# EAGLE schematic sensortester (EAGLE 7.6.0)
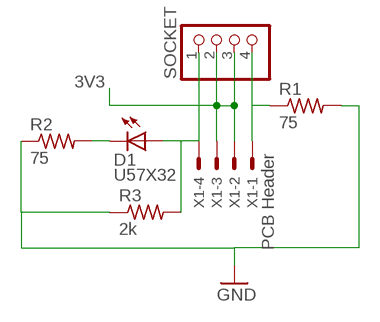
[diagram p0: schematic, sheet 1]

## Parts
D1  U57X32  [U57X32]
R1  75  R-US_0204/5  [0204/5]
R2  75  R-US_0204/5  [0204/5]
R3  2k  R-US_0204/5  [0204/5]
SOCKET  PINHD-1X4  [1X04]
X1  PCB Header  22-23-2041  [22-23-2041]

## Nets
3V3: SOCKET.2 SOCKET.3 X1.2 X1.3
GND: R1.2 R2.1 R3.1
N$1: D1.A R3.2 SOCKET.1 X1.4
N$2: R1.1 SOCKET.4 X1.1
N$3: D1.K(C) R2.2

## Library data of the parts
D1 = led:U57X32: LED rectangle, 5.7 x 3.2 mm
R1-R3 = resistor:R-US_: RESISTOR, American symbol
SOCKET = pinhead:PINHD-1X4: PIN HEADER
X1 = con-molex:22-23-2041: .100" (2.54mm) Center Header - 4 Pin; MF: MOLEX; MPN: 22-23-2041; OC_FARNELL: 1462920; OC_NEWARK: 38C0355